# Altium schematic sheet mach_sac_acquy.SchDoc
size A3
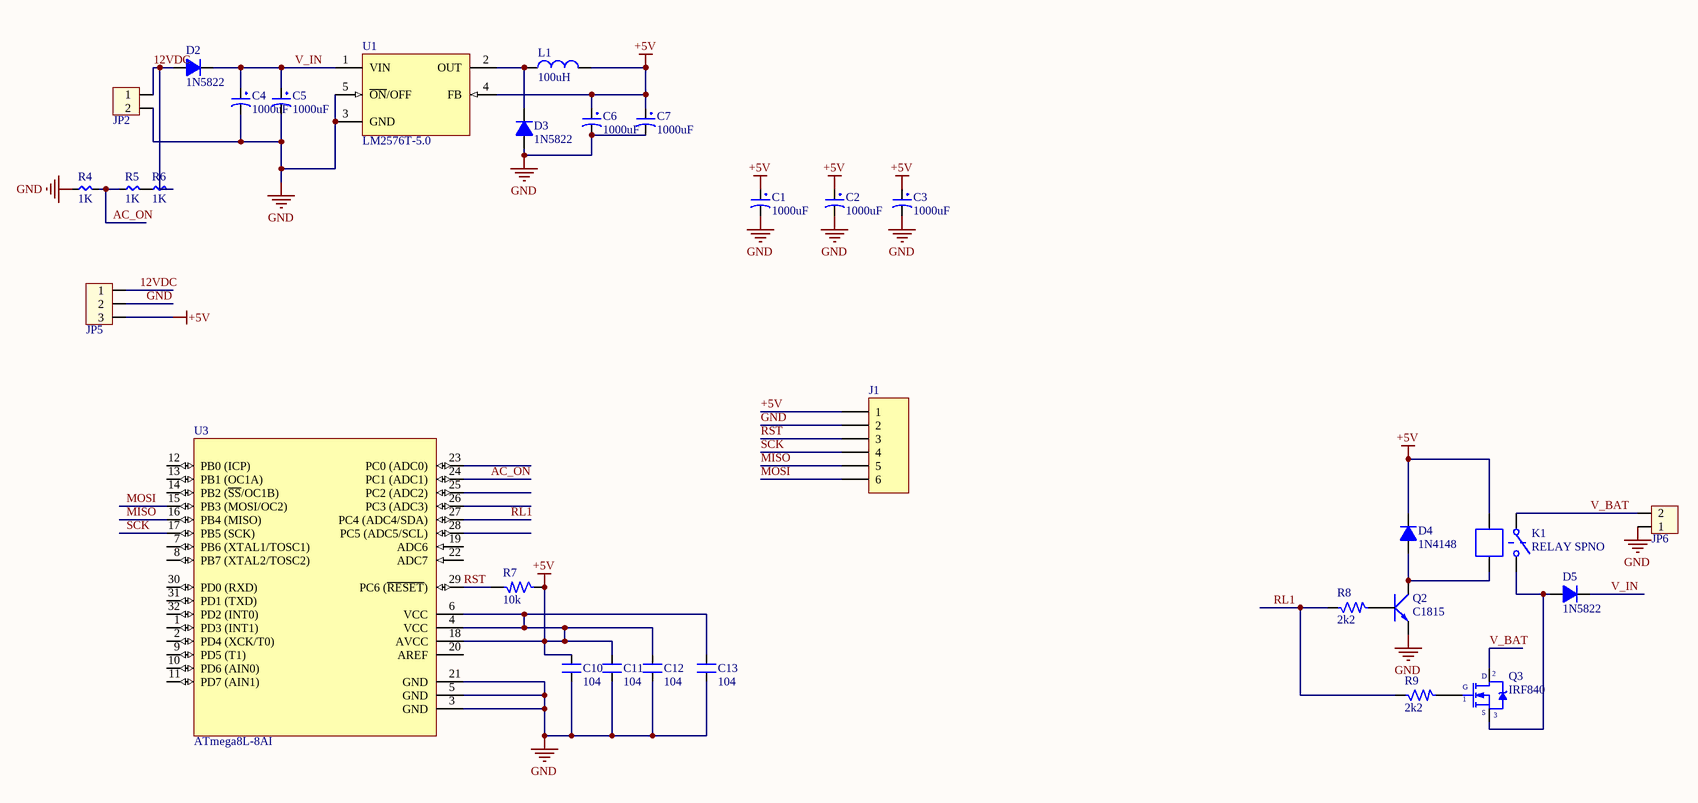
[diagram p0: mach_sac_acquy.SchDoc]

## Parts
C1  1000uF  [CP1/2]
C2  1000uF  [CP1/2]
C3  1000uF  [CP1/2]
C4  1000uF  [CP2/4]
C5  1000uF  [CP2/4]
C6  1000uF  [CP2/4]
C7  1000uF  [CP2/4]
C10  104  [SM-0805]
C11  104  [SM-0805]
C12  104  [SM-0805]
C13  104  [SM-0805]
D2  1N5822  [D5A]
D3  1N5822  [D5A]
D4  1N4148  [1n4148 smd]
D5  1N5822  [D5A]
J1  Connector 5  [HDR1X6]  (value not drawn)
JP2  Connector 2  [CON2]  (value not drawn)
JP5  Connector 3  [CON3]  (value not drawn)
JP6  Connector 2  [CON2]  (value not drawn)
K1  RELAY SPNO  [RELAY SONGCHUAN 834]
L1  100uH  [Inductor200]
Q2  C1815  [SOT23B]
Q3  IRF840  [QTO-220]
R4  1K  [SM-0805]
R5  1K  [SM-0805]
R6  1K  [SM-0805]
R7  10k  [SM-1206]
R8  2k2  [SM-0805]
R9  2k2  [SM-0805]
U1  LM2576T-5.0  [TO263-5]
U3  ATmega8L-8AI  [QFP7X7-G32/X.45N]

## Nets
+5V: C1.1 C2.1 C3.1 C6.1 C7.1 C10.2 C11.2 C12.2 C13.2 D4.2(K) J1.1 JP5.3 K1.1 L1.2 R7.1 U1.4(FB) U3.4(VCC) U3.6(VCC) U3.18(AVCC)
GND: C1.2 C2.2 C3.2 C4.2 C5.2 C6.2 C7.2 C10.1 C11.1 C12.1 C13.1 D3.1(A) J1.2 JP2.2 JP5.2 JP6.1 Q2.1(E) R4.2 U1.3(GND) U1.5(~{ON}/OFF) U3.3(GND) U3.5(GND) U3.21(GND)
12VDC: D2.1(A) JP2.1 JP5.1 R6.1
AC_ON: R4.1 R5.2 U3.24(PC1_(ADC1))
MISO: J1.5 U3.16(PB4_(MISO))
MOSI: J1.6 U3.15(PB3_(MOSI/OC2))
RL1: R8.1 R9.1 U3.27(PC4_(ADC4/SDA))
RST: J1.3 R7.2 U3.29(PC6_(~{RESET}))
SCK: J1.4 U3.17(PB5_(SCK))
V_BAT: JP6.2 K1.4 Q3.2(D)
V_IN: C4.1 C5.1 D2.2(K) D5.2(K) U1.1(VIN)
NetD3_2: D3.2(K) L1.1 U1.2(OUT)
NetD4_1: D4.1(A) K1.2 Q2.2(C)
NetD5_1: D5.1(A) K1.3 Q3.3(S)
NetQ2_3: Q2.3(B) R8.2
NetQ3_1: Q3.1(G) R9.2
NetR5_1: R5.1 R6.2

Not connected (* = marked no-connect by the designer): U3 1(PD3_(INT1)) 2(PD4_(XCK/T0)) 7(PB6_(XTAL1/TOSC1)) 8(PB7_(XTAL2/TOSC2)) 9(PD5_(T1)) 10(PD6_(AIN0)) 11(PD7_(AIN1)) 12(PB0_(ICP)) 13(PB1_(OC1A)) 14(PB2_(~{SS}/OC1B)) 19(ADC6) 20(AREF) 22(ADC7) 23(PC0_(ADC0)) 25(PC2_(ADC2)) 26(PC3_(ADC3)) 28(PC5_(ADC5/SCL)) 30(PD0_(RXD)) 31(PD1_(TXD)) 32(PD2_(INT0))

## Library data of the parts
C1-C7 = CP2: C 47uF/50V , 220uF/16V; Value: 47uF/16 - 50V; Description 1: 470uF/6,3V - 330uF/10V - 220uF/16V; Description 2: 100uF/25V - 35V - 47uF/50V - 22uF/100V; Description 3: 33uF => 47uF/63V - 1uF => 4,7uF/160V; Description 4: 1uF => 2,2uF/250V - 1uF/350V
C10-C13 = CM: Cap SMD; Value: 103
D2 D3 D5 = D5A: Diode 5A; Value: 1N5408
D4 = D1A: Diode 1A; Value: 1N4007
J1 = header 6: Header, 6-Pin; LatestRevisionDate: 17-Jul-2002; LatestRevisionNote: Re-released for DXP Platform.; Publisher: Altium Limited
JP2 JP6 = CON2: Value: Connector 2
JP5 = CON3: Value: Connector 3
K1 = RELAY SPNO: SINGLE Pole Dual-Throw Relay; Published: 24-Mar-1999; LatestRevisionDate: 17-Jul-2002; LatestRevisionNote: Re-released for DXP Platform.; PackageReference: DIP-P8; Publisher: Altium Limited; PackageDescription: Relay; 8 Leads
L1 = Inductor
Q2 = C1815: NPN 600mW, ECB; Value: C1815
Q3 = IRF840: MOSFET N - CHANNEL 500V - 0.75 - 8A - TO-220; Value: IRF840
R4-R6 = RES 0805 BUT: Resistor
R7-R9 = R: Resistor 1/4W; Value: R1/4W - 1K
U1 = LM2576T-5.0: SIMPLE SWITCHER; 3A Step-Down Voltage Regulator; Manufacturer: National Semiconductor; PackageTopMarking: NSUZXYTT*LM2576T*-5.0 P+; PowerWise: N; FirstPublished: 4-Dec-2008; DatasheetVersion: Aug-2004; PackageVersion: revJ, Jan-1992; PackageReference: T05A; Publisher: Altium Limited; PackageDescription: TO-220, Molded, 5 Lead, Straight; CompType: Switcher; PartNumber: LM2576T-5.0; RoHS: O; PinCount: 5; DigiKeyPartNumber: LM2576T-5.0-ND; Code_JEDEC: TO-220-AB; ComponentLink1Description: LM2576 Datasheet; ComponentLink1URL: http://www.national.com/ds/LM/LM2576.pdf; ComponentLink2Description: LM2576 Web Page; ComponentLink2URL: http://www.national.com/pf/LM/LM2576.html; ComponentLink3Description: T05A Package Page; ComponentLink3URL: http://www.national.com/packaging/folders/t05a.html
U3 = ATmega8L-8AI: 8-Bit AVR Microcontroller with 8K Bytes of In-System Programmable Flash Memory; Published: 17-Sep-2003; LatestRevisionDate: 13-Apr-2006; LatestRevisionNote: IPC-7351 Footprint Added.; DatasheetVersion: 2486H-AVR-09/02; PackageVersion: revB, Oct-2001; PackageReference: 32A; Publisher: Altium Limited; PackageDescription: 32-Pin Thin Quad Flat Pack 0.8 mm Pitch; Code_JEDEC: MS-026-ABA; ComponentLink1Description: Manufacturer Link; ComponentLink1URL: http://www.atmel.com; ComponentLink2Description: Datasheet; ComponentLink2URL: http://www.atmel.com/dyn/resources/prod_documents/doc2486.pdf